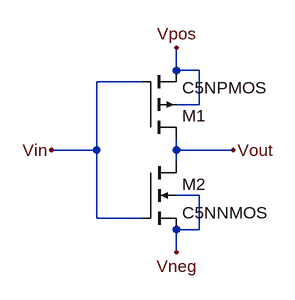
[diagram p0: schematic inverter.asc]
inverter.asc, the LTspice schematic file:
Version 4
SHEET 1 880 680
WIRE 240 64 240 32
WIRE 272 64 240 64
WIRE 192 80 128 80
WIRE 272 112 272 64
WIRE 272 112 240 112
WIRE 128 176 128 80
WIRE 128 176 64 176
WIRE 240 176 240 160
WIRE 320 176 240 176
WIRE 240 192 240 176
WIRE 272 240 240 240
WIRE 128 272 128 176
WIRE 192 272 128 272
WIRE 272 288 272 240
WIRE 272 288 240 288
WIRE 240 320 240 288
FLAG 240 32 Vpos
FLAG 240 320 Vneg
FLAG 64 176 Vin
FLAG 320 176 Vout
SYMBOL pmos4 192 160 M180
SYMATTR InstName M1
SYMATTR Value C5NPMOS
SYMATTR Value2 l=0.6u w=1.8u
SYMBOL nmos4 192 192 R0
SYMATTR InstName M2
SYMATTR Value C5NNMOS
SYMATTR Value2 l=0.6u w=1.8u

The netlist it stands for:
* inverter.asc
M1 Vout Vin Vpos Vpos C5NPMOS l=0.6u w=1.8u
M2 Vout Vin Vneg Vneg C5NNMOS l=0.6u w=1.8u
.model NMOS NMOS
.model PMOS PMOS
.lib standard.mos
.backanno
.end